# EAGLE schematic Nimble (EAGLE 7.2.0)
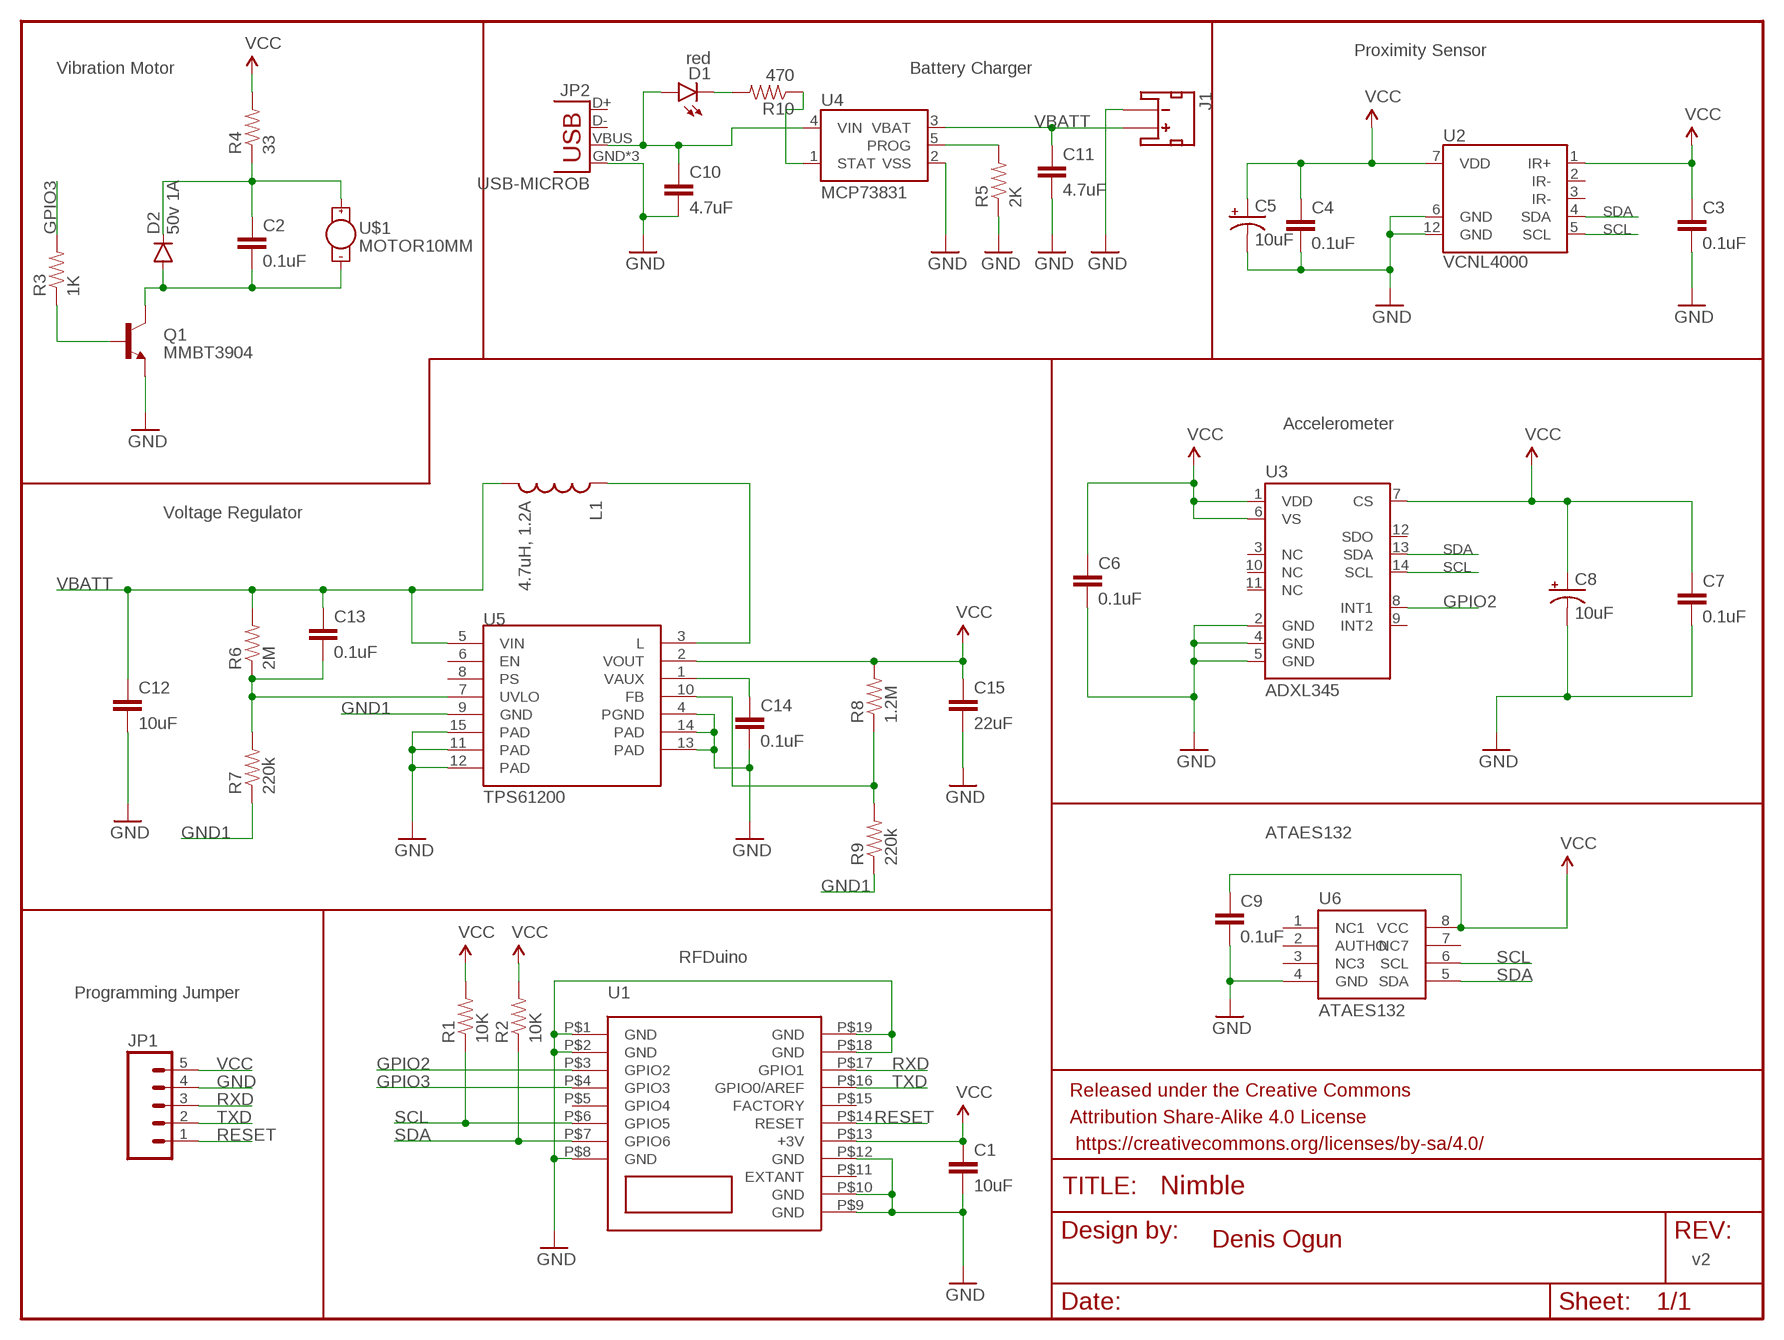
[diagram p0: schematic, sheet 1]

## Parts
C1  10uF  CAP0603-CAP  [0603-CAP]
C2  0.1uF  CAP0603-CAP  [0603-CAP]
C3  0.1uF  CAP0603-CAP  [0603-CAP]
C4  0.1uF  CAP0603-CAP  [0603-CAP]
C5  10uF  CAP_POL1206  [EIA3216]
C6  0.1uF  CAP0603-CAP  [0603-CAP]
C7  0.1uF  CAP0603-CAP  [0603-CAP]
C8  10uF  CAP_POL1206  [EIA3216]
C9  0.1uF  CAP0603-CAP  [0603-CAP]
C10  4.7uF  CAP0603-CAP  [0603-CAP]
C11  4.7uF  CAP0603-CAP  [0603-CAP]
C12  10uF  CAP1206  [1206]
C13  0.1uF  CAP0603-CAP  [0603-CAP]
C14  0.1uF  CAP0603-CAP  [0603-CAP]
C15  22uF  CAP0805  [0805]
D1  red  LED0603  [LED-0603]
D2  50v 1A  DIODESMA  [SMA-DIODE]
FRAME1  FRAME-LETTERNO_PACKAGE  [DUMMY]
J1  JST_2MM_MALE  [JST-2-SMD]
JP1  M05PTH  [1X05]
JP2  USB-MICROB  [USB-MICROB]
L1  4.7uH, 1.2A  INDUCTOR.  [CDRH2D09]
Q1  MMBT3904  TRANSISTOR_NPNMMBT2222A  [SOT23-3]
R1  10K  RESISTOR0603  [0603-RES]
R2  10K  RESISTOR0603  [0603-RES]
R3  1K  RESISTOR0603  [0603-RES]
R4  33  RESISTOR0603  [0603-RES]
R5  2K  RESISTOR0603  [0603-RES]
R6  2M  RESISTOR0603  [0603-RES]
R7  220k  RESISTOR0603  [0603-RES]
R8  1.2M  RESISTOR0603  [0603-RES]
R9  220k  RESISTOR0603  [0603-RES]
R10  470  RESISTOR0603  [0603-RES]
U1  RFD22301  [RFD22301]
U2  VCNL4000  [VCNL4000]
U3  ADXL345  [LGA14]
U4  MCP73831  [SOT23-5]
U5  TPS61200  [QFN-10_PAD]
U6  ATAES132  [SOIC8]
U$1  MOTOR10MM  [VIBE-MOTOR-10MM]

## Nets
GND: C1.2 C3.2 C4.2 C5.C(-) C6.2 C7.2 C8.C(-) C9.2 C10.2 C11.2 C12.2 C14.2 C15.2 J1.1(-) JP1.4 JP2.GND JP2.MT1(GND) JP2.MT2(GND) Q1.2(E) R5.1 U1.P$1(GND) U1.P$2(GND) U1.P$8(GND) U1.P$9(GND) U1.P$10(GND) U1.P$12(GND) U1.P$18(GND) U1.P$19(GND) U2.6(GND) U2.12(GND) U3.2(GND) U3.4(GND) U3.5(GND) U4.2(VSS) U5.4(PGND) U5.11(PAD) U5.12(PAD) U5.13(PAD) U5.14(PAD) U5.15(PAD) U6.4(GND)
GND1: R7.1 R9.1 U5.9(GND)
GPIO2: U1.P$3(GPIO2) U3.8(INT1)
GPIO3: R3.2 U1.P$4(GPIO3)
N$7: Q1.1(B) R3.1
N$9: C2.2 D2.A Q1.3(C) U$1.-
N$10: C2.1 D2.C R4.1 U$1.+
N$16: R5.2 U4.5(PROG)
N$17: L1.P$1 U5.3(L)
N$18: C13.2 R6.1 R7.2 U5.7(UVLO)
N$20: R8.1 R9.2 U5.10(FB)
N$24: R10.1 U4.1(STAT)
N$25: D1.C R10.2
RESET: JP1.1 U1.P$14(RESET)
RXD: JP1.3 U1.P$17(GPIO1)
SCL: R1.1 U1.P$6(GPIO5) U2.5(SCL) U3.14(SCL) U6.6(SCL)
SDA: R2.1 U1.P$7(GPIO6) U2.4(SDA) U3.13(SDA) U6.5(SDA)
TXD: JP1.2 U1.P$16(GPIO0/AREF)
VAUX: C14.1 U5.1(VAUX)
VBATT: C11.1 C12.1 C13.1 J1.2(+) L1.P$2 R6.2 U4.3(VBAT) U5.5(VIN)
VCC: C1.1 C3.1 C4.1 C5.A(+) C6.1 C7.1 C8.A(+) C9.1 C15.1 JP1.5 R1.2 R2.2 R4.2 R8.2 U1.P$13(+3V) U2.1(IR+) U2.7(VDD) U3.1(VDD) U3.6(VS) U3.7(CS) U5.2(VOUT) U6.8(VCC)
VIN: C10.1 D1.A JP2.VBUS U4.4(VIN)
Unconnected: J1.NC1(PAD1) J1.NC2(PAD2) JP2.D+ JP2.D- U1.P$5(GPIO4) U1.P$11(EXTANT) U1.P$15(FACTORY) U2.2(IR-) U2.3(IR-) U3.3(NC) U3.9(INT2) U3.10(NC) U3.11(NC) U3.12(SDO) U5.6(EN) U5.8(PS) U6.1(NC1) U6.2(AUTHO) U6.3(NC3) U6.7(NC7)

## Notes on the sheet
- Proximity Sensor
- Vibration Motor | Battery Charger
- Accelerometer
- Voltage Regulator
- ATAES132
- RFDuino
- Programming Jumper
- Denis Ogun
- v2

## Library data of the parts
C1-C4 C6 C7 C9-C15 = SparkFun-Capacitors:CAP: Capacitor Standard 0603 ceramic capacitor, and 0.1" leaded capacitor.
C5 C8 = SparkFun-Capacitors:CAP_POL: Capacitor Polarized These are standard SMD and PTH capacitors. Normally 10uF, 47uF, and 100uF in electrolytic and tantalum varieties. Always verify the external diameter of the through hole cap, it varies with capacity, voltage, and manufacturer. The EIA devices should be standard.
D1 = SparkFun-LED:LED: LEDs Standard schematic elements and footprints for 5mm, 3mm, 1206, and 0603 sized LEDs. 5mm - Spark Fun Electronics SKU : COM-00529 (and others)
D2 = SparkFun-DiscreteSemi:DIODE: Diode These are standard reverse protection diodes and small signal diodes. SMA package can handle up to about 1A. SOD-323 can handle about 200mA. What the SOD-323 package when ordering, there are some mfgs out there that are 5-pin packages.
FRAME1 = SparkFun-Aesthetics:FRAME-LETTER: Schematic Frame Standard 8.5x11 US Letter frame; DESIGNER: Nobody; VERSION: v01
J1 = SparkFun-Connectors:JST_2MM_MALE: Mates to single-cell LiPo batteries. CONN-08352; PROD_ID: CONN-08352
JP1 = SparkFun-Connectors:M05: Header 5 Standard 5-pin 0.1" header. Use with straight break away headers (SKU : PRT-00116), right angle break away headers (PRT-00553), swiss pins (PRT-00743), machine pins (PRT-00117), and female headers (PRT-00115). Molex polarized connector foot print use with SKU : PRT-08230 with associated crimp pins and housings.
JP2 = SparkFun-Connectors:USB: USB Connectors USB-B-PTH is fully proven SKU : PRT-00139/CONN-08278 USB-miniB is fully proven SKU : PRT-00587 USB-A-PCB is untested. USB-A-H is throughly reviewed, but untested. Spark Fun Electronics SKU : PRT-00437 USB-B-SMT is throughly reviewed, but untested. Needs silkscreen touching up. USB-A-S has not been used/tested USB-MB-H has not been used/tested USB-MICROB has been used. CONN-09505; PROD_ID: CONN-09505
L1 = SparkFun-Passives:INDUCTOR: Inductors Basic Inductor/Choke - 0603 and 1206. Footprints are not proven and vary greatly between part numbers. SRN6045- 33uH, 20% 1.4A SDR0403-560KL - 56uH, 10%, 500mA RMS/740mA peak
Q1 = SparkFun-DiscreteSemi:TRANSISTOR_NPN: Generic NPN BJT MMBT2222A - TRANS-08049 (SOT-23, 1A 40V) MPSA42 - TRANS-09116 (SOT-23, 500mA 300V) MMBT5088LT1G - TRANS-11160 (SOT-23, 50 mA 30V) BC547 - COM-08928 <http://www.sparkfun.com/products/8928> (TO-92 45V 100mA) (1.Collector 2.Base 3.Emitter) 2N3904 - COM-00521 <http://www.sparkfun.com/products/521> (TO-92 40V 200mA) (1.Emitter 2.Base 3.Collector) P2N2222A - COM-12852 <http://www.sparkfun.com/products/12852> (TO-92 40V 600mA) (1.Collector 2.Base 3.Emitter); PROD_ID: TRANS-08049; VALUE: MMBT2222A
R1-R10 = SparkFun-Resistors:RESISTOR: Resistor Basic schematic elements and footprints for 0603, 1206, and PTH resistors.
U1 = RFDuino:RFD22301
U2 = SparkFun-Sensors:VCNL4000: Fully integrated proximity and ambient light sensor with infrared emitter and I2C interface
U3 = SparkFun-Sensors:ADXL345: 3-axis SPI/I2C 2/4/8/16g accelerometer
U4 = SparkFun-PowerIC:MCP73831: Miniature single cell, fully integrated Li-Ion, Li-polymer charge management controller http://ww1.microchip.com/downloads/en/DeviceDoc/21984a.pdf IC-09995; PROD_ID: IC-09995
U5 = SparkFun-PowerIC:TPS61200: DC to DC Booster IC-10035; PROD_ID: IC-10035
U6 = SparkFun-DigitalIC:ATAES132: 32Kb Serial EEPROM. AES-128-CCM. MAC. Secure Storage for 128-bit keys. Encrypted User Memory Readn and Write. HWRNG. 2.5V to 5.5V.; PROD_ID: IC-11983
U$1 = SparkFun-Electromechanical:MOTOR: Vibration Motor- ROB-08449 Physical dimension and wire connections for this powerful vibration motor. Motor has a self adhesive backing.